# Altium schematic sheet Input_dig.SchDoc
size A4; DocumentNumber: 3; SheetNumber: 3; SheetTotal: 11
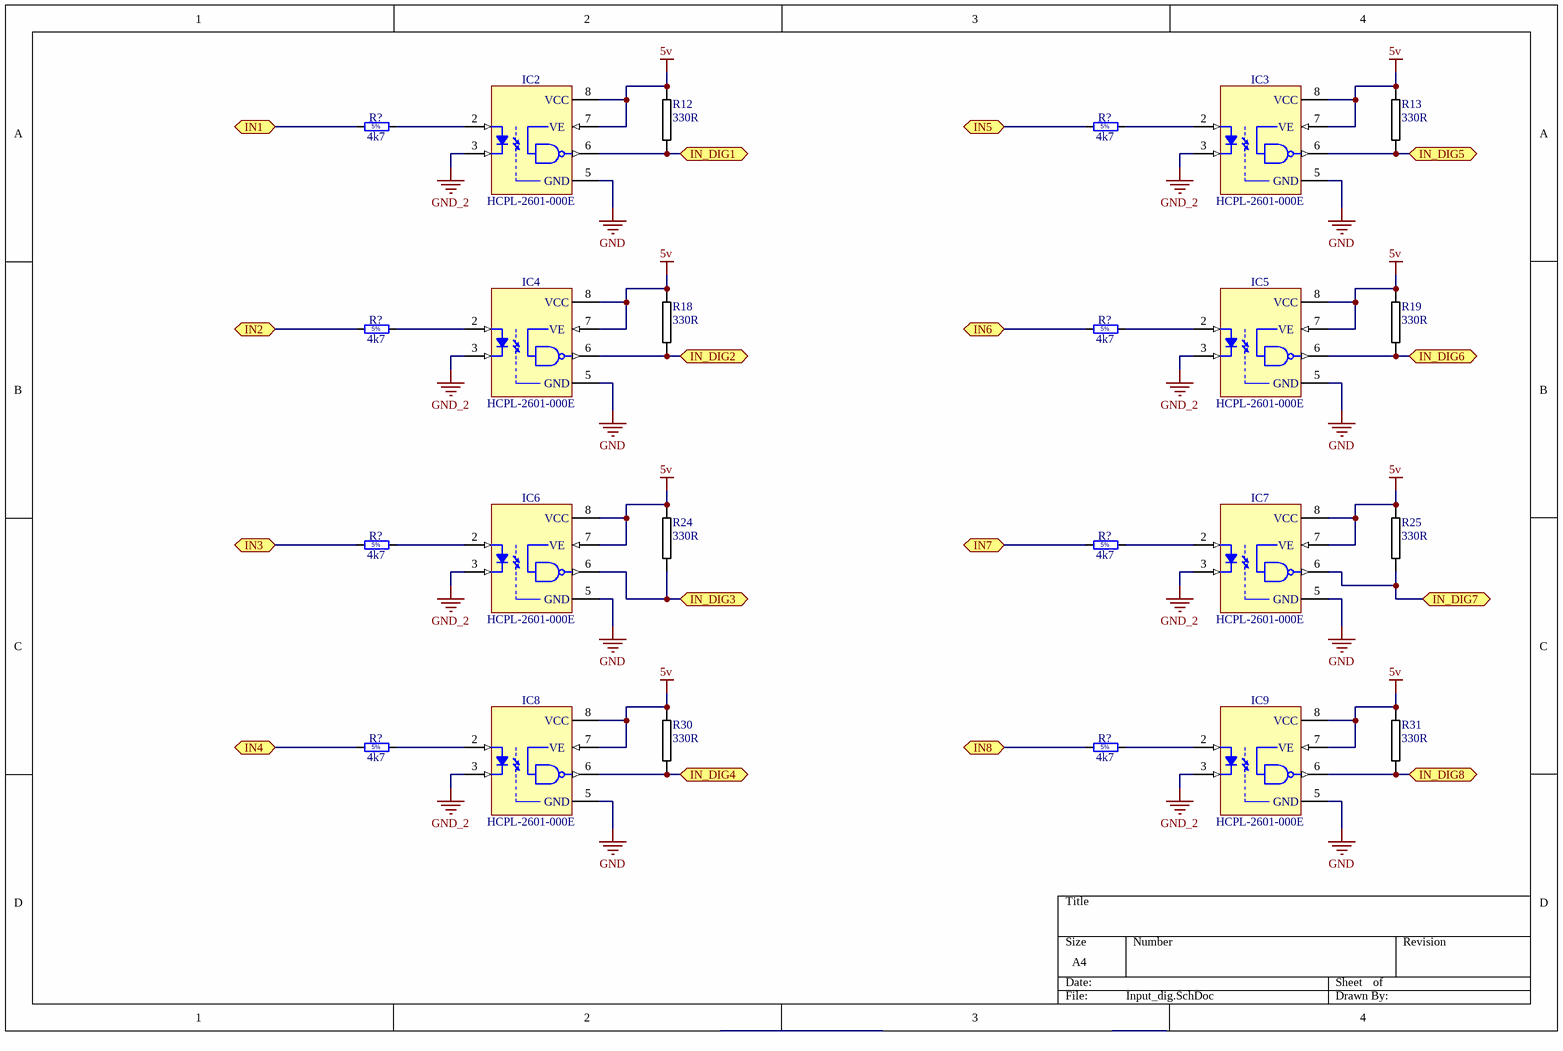
[diagram p0: Input_dig.SchDoc]

## Parts
(Parts that share a designator on the sheet are numbered #1, #2 ... from top to bottom, then left to right.)
IC2  HCPL-2601-000E  [DIP8-300]
IC3  HCPL-2601-000E  [DIP8-300]
IC4  HCPL-2601-000E  [DIP8-300]
IC5  HCPL-2601-000E  [DIP8-300]
IC6  HCPL-2601-000E  [DIP8-300]
IC7  HCPL-2601-000E  [DIP8-300]
IC8  HCPL-2601-000E  [DIP8-300]
IC9  HCPL-2601-000E  [DIP8-300]
R12  330R  [0805R-330]
R13  330R  [0805R-330]
R18  330R  [0805R-330]
R19  330R  [0805R-330]
R24  330R  [0805R-330]
R25  330R  [0805R-330]
R30  330R  [0805R-330]
R31  330R  [0805R-330]
R?#1  4k7  [RES2286-1670X520]
R?#2  4k7  [RES2286-1670X520]
R?#3  4k7  [RES2286-1670X520]
R?#4  4k7  [RES2286-1670X520]
R?#5  4k7  [RES2286-1670X520]
R?#6  4k7  [RES2286-1670X520]
R?#7  4k7  [RES2286-1670X520]
R?#8  4k7  [RES2286-1670X520]

## Ports
IN1, IN2, IN3, IN4, IN5, IN6, IN7, IN8, IN_DIG1, IN_DIG2, IN_DIG3, IN_DIG4, IN_DIG5, IN_DIG6, IN_DIG7, IN_DIG8

## Nets
5v: IC2.7(VE) IC2.8(VCC) IC3.7(VE) IC3.8(VCC) IC4.7(VE) IC4.8(VCC) IC5.7(VE) IC5.8(VCC) IC6.7(VE) IC6.8(VCC) IC7.7(VE) IC7.8(VCC) IC8.7(VE) IC8.8(VCC) IC9.7(VE) IC9.8(VCC) R12.1 R13.1 R18.1 R19.1 R24.1 R25.1 R30.1 R31.1
GND: IC2.5(GND) IC3.5(GND) IC4.5(GND) IC5.5(GND) IC6.5(GND) IC7.5(GND) IC8.5(GND) IC9.5(GND)
GND_2: IC2.3(K) IC3.3(K) IC4.3(K) IC5.3(K) IC6.3(K) IC7.3(K) IC8.3(K) IC9.3(K)
IN1: R?#1.1 ; port IN1
IN2: R?#3.1 ; port IN2
IN3: R?#5.1 ; port IN3
IN4: R?#7.1 ; port IN4
IN5: R?#2.1 ; port IN5
IN6: R?#4.1 ; port IN6
IN7: R?#6.1 ; port IN7
IN8: R?#8.1 ; port IN8
IN_DIG1: IC2.6(VO) R12.2 ; port IN_DIG1
IN_DIG2: IC4.6(VO) R18.2 ; port IN_DIG2
IN_DIG3: IC6.6(VO) R24.2 ; port IN_DIG3
IN_DIG4: IC8.6(VO) R30.2 ; port IN_DIG4
IN_DIG5: IC3.6(VO) R13.2 ; port IN_DIG5
IN_DIG6: IC5.6(VO) R19.2 ; port IN_DIG6
IN_DIG7: IC7.6(VO) R25.2 ; port IN_DIG7
IN_DIG8: IC9.6(VO) R31.2 ; port IN_DIG8
NetIC2_2: IC2.2(A) R?#1.2
NetIC3_2: IC3.2(A) R?#2.2
NetIC4_2: IC4.2(A) R?#3.2
NetIC5_2: IC5.2(A) R?#4.2
NetIC6_2: IC6.2(A) R?#5.2
NetIC7_2: IC7.2(A) R?#6.2
NetIC8_2: IC8.2(A) R?#7.2
NetIC9_2: IC9.2(A) R?#8.2

## Notes on the sheet
- (in symbol RMF_4K7_5%_3W_250PPM_2286-1670X520) 5%

## Library data of the parts
IC2-IC9 = HCPL-2601-000E: Single Optocoupler; Part Description: High CMR, High Speed TTL Compatible Optocouplers; Manufacturer: AVAGO TECHNOLOGIES; Table: Optocouplers; Part Number: HCPL-2601-000E; Component Kind: Standard; Component Type: Standard; Device: HCPL-2601-000E; PackageDescription: DIP; 8 Leads; Row Spacing 7.62 mm; Pitch 2.54 mm; Manufacturer Part Number: HCPL-2601-000E; Pin Count: 8; Case: DIP8-300; Mounted: Yes; Socket: Yes; SMD: No; ComponentHeight: 4.7mm; HelpURL: \\cern.ch\dfs\Applications\Altium\Datasheets\HCPL-2601-000E.pdf; Author: CERN DEM JLC; CreateDate: 30/03/2009; LatestRevisionDate: 30/03/2009
R12 R13 R18 R19 R24 R25 R30 R31 = 0805R-330: RESISTOR 0805 1/4 WATT THIN FILM; Reel: *
R?#1-R?#8 = RMF_4K7_5%_3W_250PPM_2286-1670X520: Resistor - 5%; Part Description: Leaded Power Metal Film Resistor; Manufacturer: GENERIC; Manufacturer1 Part Number: PR03000204701JAC00; Power: 3W; TC: ±250ppm/°C; Table: Resistors THD; Part Number: RMF_4K7_5%_3W_250PPM_2286-1670X520; Component Kind: Standard; Component Type: Standard; Pin Count: 2; Value: 4k7; Status: Preferred; Tolerance: ±5%; Manufacturer Part Number: RMF_4K7_5%_3W_250PPM_2286-1670X520; Case: LS22.86 L16.7 x D5.2; Mounted: Yes; Socket: No; SMD: No; ComponentHeight: 5.2mm; Manufacturer1 Example: VISHAY BCCOMPONENT; Manufacturer1 ComponentHeight: 5.2mm; HelpURL: \\cern.ch\dfs\Applications\Altium\Datasheets\RMF_VISHAY_PR03.pdf; Author: CERN DEM JLC; CreateDate: 19/06/2008; LatestRevisionDate: 01/10/2012